# Altium schematic sheet pay-ssm.SchDoc
size A4; DocumentNumber: 1; SheetNumber: 1; SheetTotal: 11
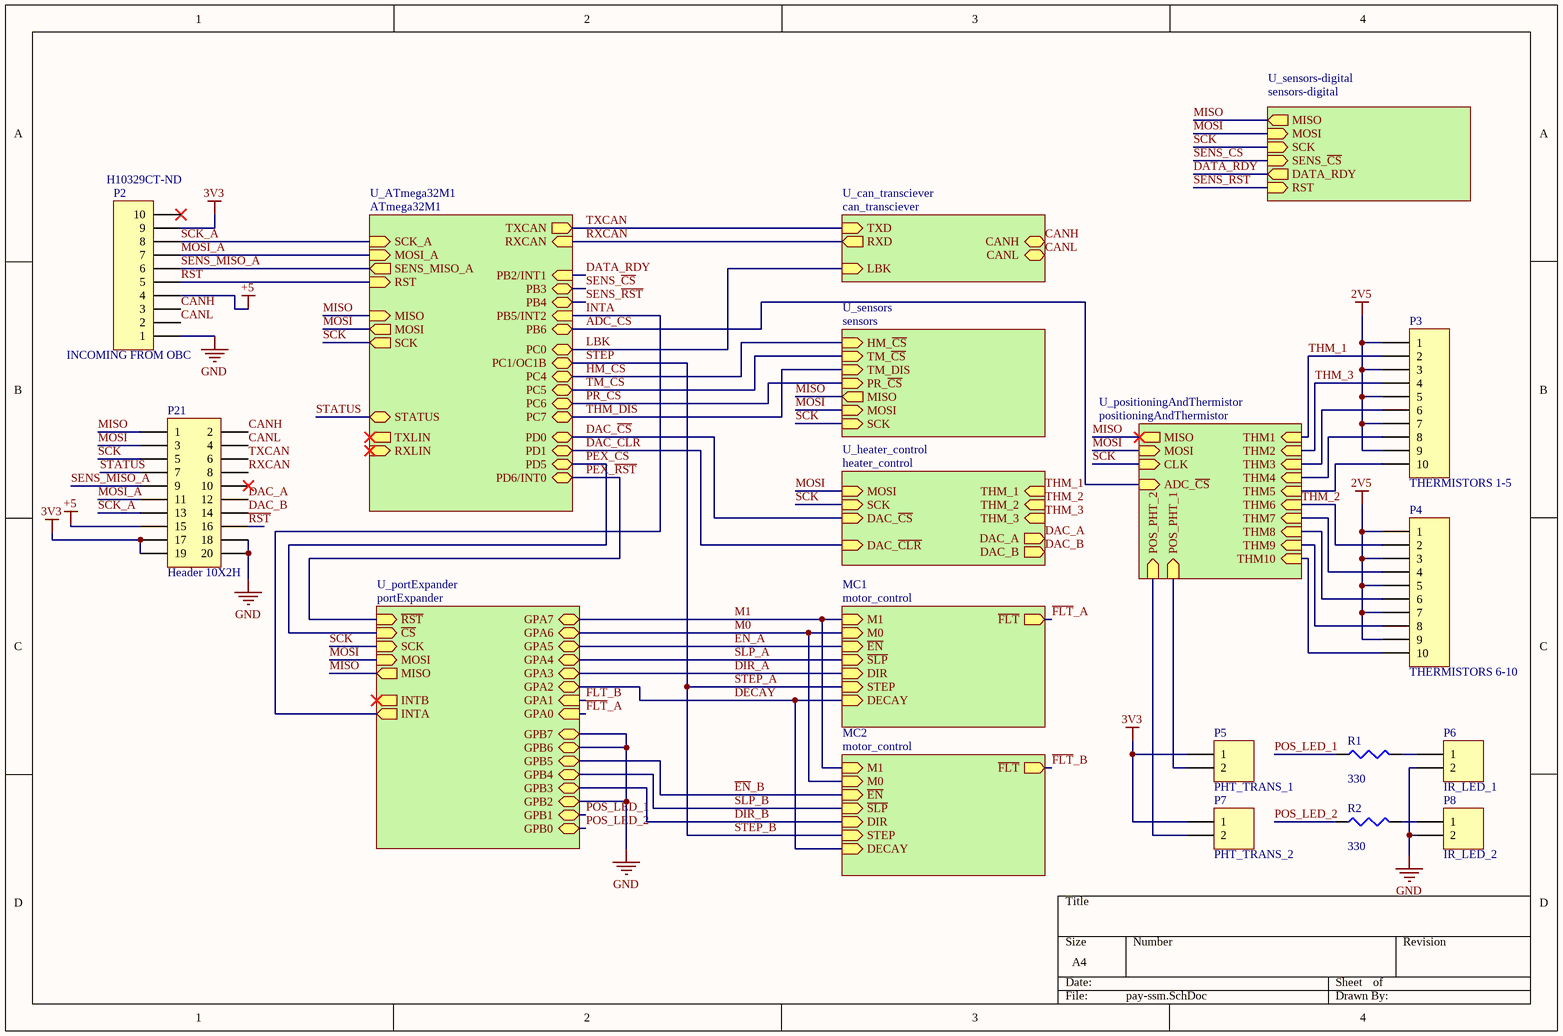
[diagram p0: pay-ssm.SchDoc]

## Parts
P2  INCOMING FROM OBC  Supplier Part Number: H10329CT-ND  [DF14-10P-1.25H(55)]
P3  THERMISTORS 1-5  [DF14-10P-1.25H(55)]
P4  THERMISTORS 6-10  [DF14-10P-1.25H(55)]
P5  PHT_TRANS_1  [DF14-2P-1.25H(55)]
P6  IR_LED_1  [DF14-2P-1.25H(55)]
P7  PHT_TRANS_2  [DF14-2P-1.25H(55)]
P8  IR_LED_2  [DF14-2P-1.25H(55)]
P21  Header 10X2H  [HDR2X10]
R1  330  [J1-0603]
R2  330  [J1-0603]

## Sub-sheets
MC1 = motor_control: M1 (in), M0 (in), ~{EN} (in), ~{SLP} (in), DIR (in), STEP (in), DECAY (in), ~{FLT} (out)
MC2 = motor_control: M1 (in), M0 (in), ~{EN} (in), ~{SLP} (in), DIR (in), STEP (in), DECAY (in), ~{FLT} (out)
U_ATmega32M1 = ATmega32M1: MISO (in), MOSI (out), SCK (out), TXCAN (out), RXCAN (in), PB3 (bidir), PB4 (bidir), PB5/INT2 (in), PB6 (bidir), PC0 (bidir), PC4 (bidir), PC5 (bidir), PC6 (bidir), PC7 (bidir), PD0 (bidir), PD1 (bidir), PD5 (bidir), RXLIN (in), TXLIN (out), RST (in), MOSI_A (in), SCK_A (in), SENS_MISO_A (out), PC1/OC1B (bidir), PD6/INT0 (bidir), PB2/INT1 (in), STATUS (bidir)
U_can_transciever = can_transciever: RXD (out), TXD (in), LBK (in), CANL (bidir), CANH (bidir)
U_heater_control = heater_control: SCK (in), DAC_~{CLR} (in), MOSI (in), THM_2 (in), DAC_~{CS} (in), THM_1 (in), THM_3 (in), DAC_A (out), DAC_B (out)
U_portExpander = portExpander: ~{RST} (in), ~{CS} (in), SCK (in), MOSI (in), MISO (out), GPA7 (bidir), GPA6 (bidir), GPA5 (bidir), GPA4 (bidir), GPA3 (bidir), GPA2 (bidir), GPA1 (in), GPA0 (in), GPB7 (bidir), GPB6 (bidir), GPB5 (bidir), GPB4 (bidir), GPB3 (bidir), GPB2 (bidir), GPB1 (bidir), GPB0 (bidir), INTB (out), INTA (out)
U_positioningAndThermistor = positioningAndThermistor: THM1 (in), THM2 (in), THM3 (in), THM4 (in), THM5 (in), THM6 (in), THM7 (in), THM8 (in), THM9 (in), THM10 (in), MISO (out), MOSI (in), CLK (in), POS_PHT_2 (in), POS_PHT_1 (in), ADC_~{CS} (in)
U_sensors = sensors: HM_~{CS} (in), TM_~{CS} (in), TM_DIS (in), PR_~{CS} (in), SCK (in), MOSI (in), MISO (out)
U_sensors-digital = sensors-digital: MISO (out), MOSI (in), SCK (in), SENS_~{CS} (in), DATA_RDY (out), RST (in)

## Nets
2V5: P3.1 P3.3 P3.5 P3.7 P3.9 P4.1 P4.3 P4.5 P4.7 P4.9
3V3: P2.9 P5.1 P7.1 P21.17 P21.19
+5: P2.4 P21.15
GND: P2.1 P6.2 P8.2 P21.18 P21.20 ; sheet U_portExpander/GPB7, sheet U_portExpander/GPB6, sheet U_portExpander/GPB2
ADC_~{CS}: sheet U_ATmega32M1/PB6, sheet U_positioningAndThermistor/ADC_~{CS}
CANH: P2.3 P21.2 ; sheet U_can_transciever/CANH
CANL: P2.2 P21.4 ; sheet U_can_transciever/CANL
DAC_A: P21.12 ; sheet U_heater_control/DAC_A
DAC_B: P21.14 ; sheet U_heater_control/DAC_B
DAC_~{CLR}: sheet U_ATmega32M1/PD1, sheet U_heater_control/DAC_~{CLR}
DAC_~{CS}: sheet U_ATmega32M1/PD0, sheet U_heater_control/DAC_~{CS}
DATA_RDY: sheet U_ATmega32M1/PB2/INT1, sheet U_sensors-digital/DATA_RDY
DECAY: sheet MC2/DECAY, sheet U_portExpander/GPA2, sheet MC1/DECAY
DIR_A: sheet U_portExpander/GPA3, sheet MC1/DIR
DIR_B: sheet MC2/DIR, sheet U_portExpander/GPB3
~{EN}_A: sheet U_portExpander/GPA5, sheet MC1/~{EN}
~{EN}_B: sheet MC2/~{EN}, sheet U_portExpander/GPB5
~{FLT}_A: sheet U_portExpander/GPA0, sheet MC1/~{FLT}
~{FLT}_B: sheet MC2/~{FLT}, sheet U_portExpander/GPA1
HM_~{CS}: sheet U_ATmega32M1/PC4, sheet U_sensors/HM_~{CS}
INTA: sheet U_ATmega32M1/PB5/INT2, sheet U_portExpander/INTA
LBK: sheet U_ATmega32M1/PC0, sheet U_can_transciever/LBK
M0: sheet MC2/M0, sheet U_portExpander/GPA6, sheet MC1/M0
M1: sheet MC2/M1, sheet U_portExpander/GPA7, sheet MC1/M1
MISO: P21.1 ; sheet U_ATmega32M1/MISO, sheet U_sensors/MISO, sheet U_portExpander/MISO, sheet U_positioningAndThermistor/MISO, sheet U_sensors-digital/MISO
MOSI: P21.3 ; sheet U_ATmega32M1/MOSI, sheet U_sensors/MOSI, sheet U_heater_control/MOSI, sheet U_portExpander/MOSI, sheet U_positioningAndThermistor/MOSI, sheet U_sensors-digital/MOSI
MOSI_A: P2.7 P21.11 ; sheet U_ATmega32M1/MOSI_A
PEX_~{CS}: sheet U_ATmega32M1/PD5, sheet U_portExpander/~{CS}
PEX_~{RST}: sheet U_ATmega32M1/PD6/INT0, sheet U_portExpander/~{RST}
POS_LED_1: R1.1 ; sheet U_portExpander/GPB1
POS_LED_2: R2.1 ; sheet U_portExpander/GPB0
PR_~{CS}: sheet U_ATmega32M1/PC6, sheet U_sensors/PR_~{CS}
~{RST}: P2.5 P21.16 ; sheet U_ATmega32M1/RST
RXCAN: P21.8 ; sheet U_ATmega32M1/RXCAN, sheet U_can_transciever/RXD
~{SLP}_A: sheet U_portExpander/GPA4, sheet MC1/~{SLP}
~{SLP}_B: sheet MC2/~{SLP}, sheet U_portExpander/GPB4
SCK: P21.5 ; sheet U_ATmega32M1/SCK, sheet U_sensors/SCK, sheet U_heater_control/SCK, sheet U_portExpander/SCK, sheet U_positioningAndThermistor/CLK, sheet U_sensors-digital/SCK
SCK_A: P2.8 P21.13 ; sheet U_ATmega32M1/SCK_A
SENS_~{CS}: sheet U_ATmega32M1/PB3, sheet U_sensors-digital/SENS_~{CS}
SENS_MISO_A: P2.6 P21.9 ; sheet U_ATmega32M1/SENS_MISO_A
SENS_~{RST}: sheet U_ATmega32M1/PB4, sheet U_sensors-digital/RST
STATUS: P21.7 ; sheet U_ATmega32M1/STATUS
STEP: sheet U_ATmega32M1/PC1/OC1B, sheet MC2/STEP, sheet MC1/STEP  [also labelled STEP_A, STEP_B]
THM_1: P3.2 ; sheet U_heater_control/THM_1, sheet U_positioningAndThermistor/THM1
THM_2: P4.2 ; sheet U_heater_control/THM_2, sheet U_positioningAndThermistor/THM6
THM_3: P3.4 ; sheet U_heater_control/THM_3, sheet U_positioningAndThermistor/THM2
THM_DIS: sheet U_ATmega32M1/PC7, sheet U_sensors/TM_DIS
TM_~{CS}: sheet U_ATmega32M1/PC5, sheet U_sensors/TM_~{CS}
TXCAN: P21.6 ; sheet U_ATmega32M1/TXCAN, sheet U_can_transciever/TXD
NetP3_6: P3.6 ; sheet U_positioningAndThermistor/THM3
NetP3_8: P3.8 ; sheet U_positioningAndThermistor/THM4
NetP3_10: P3.10 ; sheet U_positioningAndThermistor/THM5
NetP4_4: P4.4 ; sheet U_positioningAndThermistor/THM7
NetP4_6: P4.6 ; sheet U_positioningAndThermistor/THM8
NetP4_8: P4.8 ; sheet U_positioningAndThermistor/THM9
NetP4_10: P4.10 ; sheet U_positioningAndThermistor/THM10
NetP5_2: P5.2 ; sheet U_positioningAndThermistor/POS_PHT_1
NetP6_1: P6.1 R1.2
NetP7_2: P7.2 ; sheet U_positioningAndThermistor/POS_PHT_2
NetP8_1: P8.1 R2.2

Not connected (* = marked no-connect by the designer): P2 10*; P21 10*

## Library data of the parts
P2-P4 = Header 10: Header, 10-Pin; LatestRevisionDate: 17-Jul-2002; LatestRevisionNote: Re-released for DXP Platform.; Publisher: Altium Limited; Supplier: Digi-Key
P5-P8 = Header 2: Header, 2-Pin; LatestRevisionDate: 17-Jul-2002; LatestRevisionNote: Re-released for DXP Platform.; Publisher: Altium Limited; Supplier: Digi-Key
P21 = Header 10X2H: Header, 10-Pin, Dual row, Right Angle; LatestRevisionDate: 17-Jul-2002; LatestRevisionNote: Re-released for DXP Platform.; Publisher: Altium Limited
R1 R2 = Res3: Resistor; Published: 8-Jun-2000; LatestRevisionDate: 29-May-2009; LatestRevisionNote: IPC-7351 Footprint Added.; PackageReference: J1-0603; Publisher: Altium Limited; PackageDescription: Chip Resistor; Value: 330; Supplier: Digi-Key